# EAGLE design c64 sram at chr-rom (EAGLE 7.3.0)
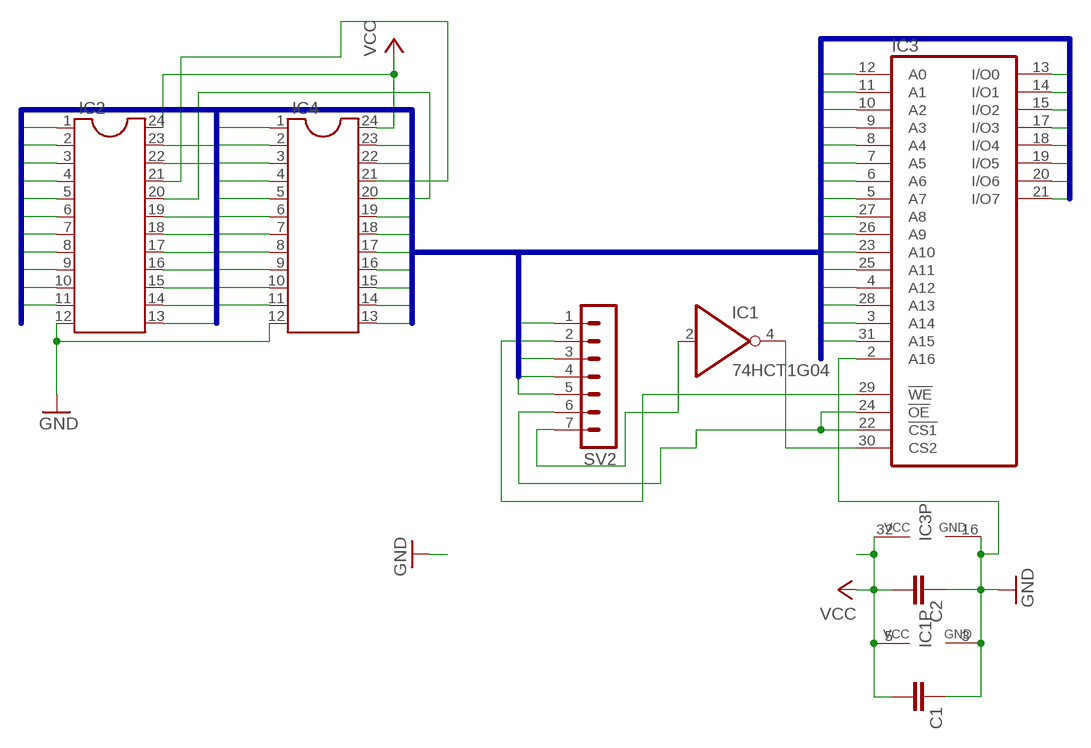
[diagram p0: schematic, sheet 1]

## Parts
C1  C-EUC0805  [C0805]
C2  C-EUC0805  [C0805]
IC1  74HCT1G04  74AHC1G04DBV  [SOT23-5]
IC2  DIL24-6  [DIL24-6]
IC3  LP621024CM  [SOP32L]
IC4  DIL24-6  [DIL24-6]
SV2  MA07-1  [MA07-1]

## Nets
A0: IC2.8 IC3.12(A0) IC4.8
A1: IC2.7 IC3.11(A1) IC4.7
A2: IC2.6 IC3.10(A2) IC4.6
A3: IC2.5 IC3.9(A3) IC4.5
A4: IC2.4 IC3.8(A4) IC4.4
A5: IC2.3 IC3.7(A5) IC4.3
A6: IC2.2 IC3.6(A6) IC4.2
A7: IC2.1 IC3.5(A7) IC4.1
A8: IC2.23 IC3.27(A8) IC4.23
A9: IC2.22 IC3.26(A9) IC4.22
A10: IC2.19 IC3.23(A10) IC4.19
A11: IC2.18 IC3.25(A11) IC4.18
A12: IC3.4(A12) SV2.5
A13: IC3.28(A13) SV2.3
A14: IC3.3(A14) SV2.4
A15: IC3.31(A15) SV2.1
D0: IC2.9 IC3.13(I/O0) IC4.9
D1: IC2.10 IC3.14(I/O1) IC4.10
D2: IC2.11 IC3.15(I/O2) IC4.11
D3: IC2.13 IC3.21(I/O7) IC4.13
D4: IC2.14 IC3.20(I/O6) IC4.14
D5: IC2.15 IC3.19(I/O5) IC4.15
D6: IC2.16 IC3.18(I/O4) IC4.16
D7: IC2.17 IC3.17(I/O3) IC4.17
GND: C1.1 C2.1 IC1.3(GND) IC2.12 IC3.2(A16) IC3.16(GND) IC4.12
N$1: IC2.21 IC4.21
N$3: IC1.4(O) IC3.30(CS2)
N$4: IC2.20 IC4.20
N$10: IC1.2(I) SV2.7
N$11: IC3.22(!CS1) IC3.24(!OE) SV2.6
R/_W: IC3.29(!WE) SV2.2
VCC: C1.2 C2.2 IC1.5(VCC) IC2.24 IC3.32(VCC) IC4.24
Unconnected: IC3.1(NC)

## Buses
A[0..16],D[0..7]

## Library data of the parts
C1 C2 = rcl:C-EU: CAPACITOR, European symbol
IC1 = 74xx-little-de:74*1G04: INVERTER Gate
IC2 IC4 = ic-package:DIL24: Dual In Line
IC3 = memory:LP621024CM: MEMORY
SV2 = con-lstb:MA07-1: PIN HEADER; OC_FARNELL: unknown; OC_NEWARK: unknown

## Board
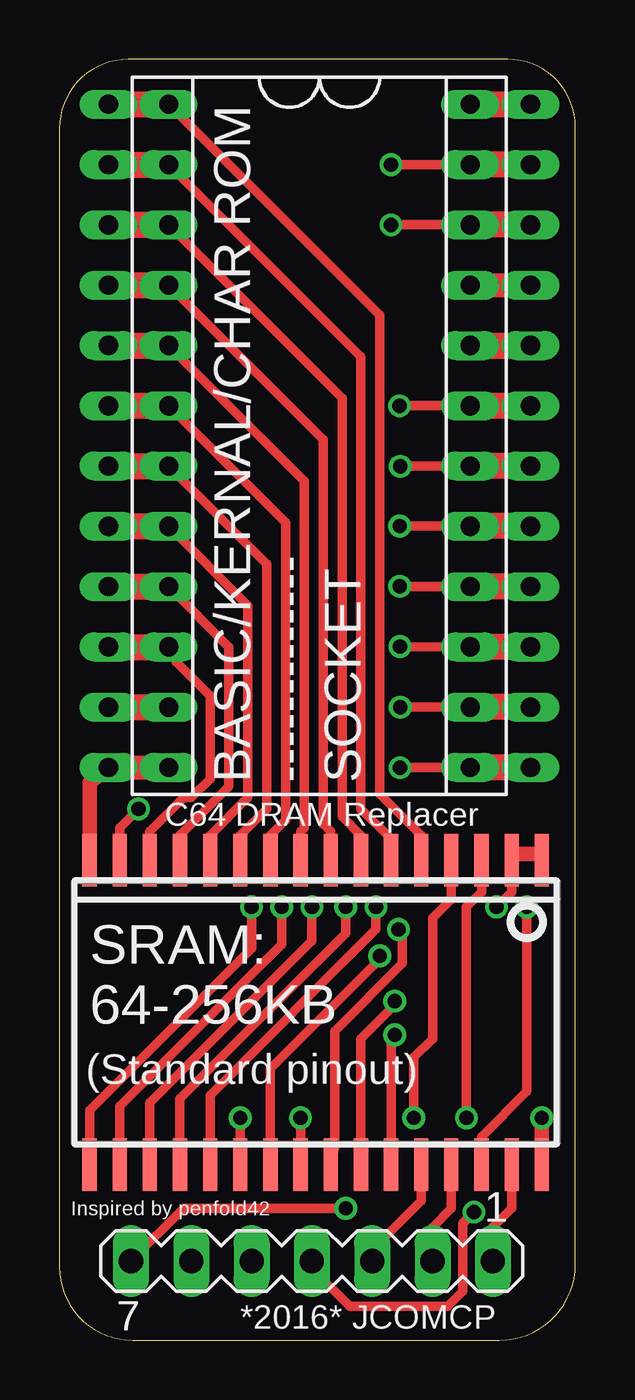
[diagram p1: board, top side]
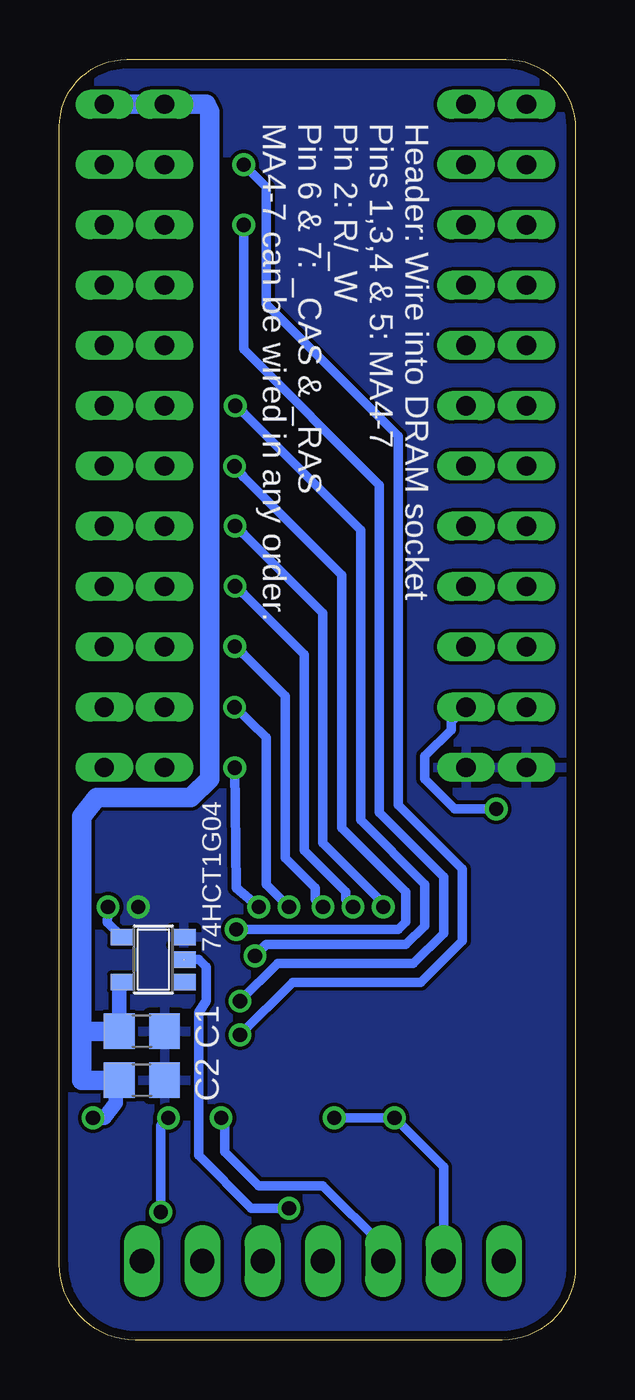
[diagram p2: board, bottom side, seen from below]

Size 21.74 x 53.96 mm. Coordinates in mm from the lower left corner, seen from the top.
Outline: 0,51.06 0,3.08 arc90 3.08,0 18.53,0 arc90 21.74,3.2 21.74,51.12 arc90 18.89,53.97 2.91,53.97 arc90 0,51.06
Copper layers (1*16): Top 0.0356mm / dielectric 1.5011mm / Bottom 0.0356mm
Design rules "oshpark-2layer": minimum track width 6mil, minimum drill 13mil, track to track 6mil, track to pad 6mil, pad to pad 6mil, via to via 6mil, smd to smd 6mil, copper to edge 15mil, drill to drill 6mil, minimum pad ring 7mil, minimum via ring 7mil, stop-mask expansion 4mil, vias tented up to drill 0mil, thermal gap 10mil

### Footprints (pad centres in the part's own frame; a part is rotated, then mirrored left to right if it is on the bottom)
C0805 = smd 1.3 x 1.5: 1 -0.95,0; 2 0.95,0
SOT23-5 = smd 0.69 x 0.99: 1 -0.95,-1.29; 2 0,-1.29; 3 0.95,-1.29; 4 0.95,1.3; 5 -0.95,1.3
DIL24-6 = drill 0.813 long: 1 -13.97,-7.62; 2 -11.43,-7.62; 3 -8.89,-7.62; 4 -6.35,-7.62; 5 -3.81,-7.62; 6 -1.27,-7.62; 7 1.27,-7.62; 8 3.81,-7.62; 9 6.35,-7.62; 10 8.89,-7.62; 11 11.43,-7.62; 12 13.97,-7.62; 13 13.97,7.62; 14 11.43,7.62; 15 8.89,7.62; 16 6.35,7.62; 17 3.81,7.62; 18 1.27,7.62; 19 -1.27,7.62; 20 -3.81,7.62; 21 -6.35,7.62; 22 -8.89,7.62; 23 -11.43,7.62; 24 -13.97,7.62
SOP32L = smd 0.6 x 2.2: 1 -9.525,-6.416; 2 -8.255,-6.416; 3 -6.985,-6.416; 4 -5.715,-6.416; 5 -4.445,-6.416; 6 -3.175,-6.416; 7 -1.905,-6.416; 8 -0.635,-6.416; 9 0.635,-6.416; 10 1.905,-6.416; 11 3.175,-6.416; 12 4.445,-6.416; 13 5.715,-6.416; 14 6.985,-6.416; 15 8.255,-6.416; 16 9.525,-6.416; 17 9.525,6.416; 18 8.255,6.416; 19 6.985,6.416; 20 5.715,6.416; 21 4.445,6.416; 22 3.175,6.416; 23 1.905,6.416; 24 0.635,6.416; 25 -0.635,6.416; 26 -1.905,6.416; 27 -3.175,6.416; 28 -4.445,6.416; 29 -5.715,6.416; 30 -6.985,6.416; 31 -8.255,6.416; 32 -9.525,6.416
MA07-1 = drill 1.016 long: 1 -7.62,0; 2 -5.08,0; 3 -2.54,0; 4 0,0; 5 2.54,0; 6 5.08,0; 7 7.62,0

### Placement (x,y rotation side)
C1  18.26,10.95 180 bottom
C2  18.26,13.02 180 bottom
IC1  17.78,16.03 90 bottom
IC2  9.68,38.1 270 top
IC3  10.79,13.81 180 top
IC4  12.22,38.1 270 top
SV2  10.64,3.33 180 top

### Tracks (layer width: path | path; a pad name or v marks a point on that pad's centre or on a via)
A0
  Top 0.406: IC3.12 6.35,21.27 7.94,22.86 7.94,30.96 IC4.8
  Top 1.1: IC2.8 IC4.8
A1
  Top 0.406: IC3.11 7.62,21.27 8.73,22.38 8.73,32.7 IC4.7
  Top 1.1: IC2.7 IC4.7
A2
  Top 0.406: IC3.10 8.89,21.27 9.53,21.91 9.53,34.45 IC4.6
  Top 1.1: IC2.6 IC4.6
A3
  Top 0.406: IC3.9 10.16,21.43 10.32,21.59 10.32,36.2 IC4.5
  Top 1.1: IC2.5 IC4.5
A4
  Top 0.406: IC3.8 11.43,21.43 11.11,21.75 11.11,37.94 IC4.4
  Top 1.1: IC2.4 IC4.4
A5
  Top 0.406: IC3.7 12.7,21.27 11.91,22.07 11.91,39.69 IC4.3
  Top 1.1: IC2.3 IC4.3
A6
  Top 0.406: IC3.6 13.97,21.11 12.7,22.38 12.7,41.43 IC4.2
  Top 1.1: IC2.2 IC4.2
A7
  Top 0.406: IC3.5 15.24,21.27 13.49,23.02 13.49,43.18 IC4.1
  Top 1.1: IC2.1 IC4.1
A8  (via drill 0.6)
  Top 0.406: IC2.23 v13.97,49.53 | v14.13,12.86 13.97,12.7 IC3.27
  Top 1.1: IC4.23 IC2.23
  Bottom 0.406: v13.97,49.53 13.02,48.58 13.02,43.66 7.46,38.1 7.46,22.54 4.76,19.84 4.76,16.83 6.51,15.08 11.91,15.08 v14.13,12.86
A9  (via drill 0.6)
  Top 0.406: IC2.22 v13.97,46.99 | v14.13,14.29 14.13,14.13 12.7,12.7 IC3.26
  Top 1.1: IC4.22 IC2.22
  Bottom 0.406: v13.97,46.99 13.97,41.75 8.26,36.04 8.26,22.23 5.56,19.53 5.56,17.15 6.83,15.88 12.54,15.88 v14.13,14.29
A10  (via drill 0.6)
  Top 0.406: IC2.19 v14.33,39.37 | v13.49,16.19 13.49,16.03 8.89,11.43 IC3.23
  Top 1.1: IC2.19 IC4.19
  Bottom 0.406: v14.33,39.37 13.97,39.05 9.05,34.13 9.05,21.91 6.35,19.21 6.35,17.46 7.14,16.67 13.02,16.67 v13.49,16.19
A11  (via drill 0.6)
  Top 0.406: IC2.18 v14.36,36.82 | v14.29,17.3 14.45,16.99 14.45,15.88 11.59,13.02 11.59,8.19 IC3.25
  Top 1.1: IC4.18 IC2.18
  Bottom 0.406: v14.36,36.82 13.97,36.35 9.84,32.23 9.84,21.59 7.14,18.89 7.14,17.62 7.46,17.3 v14.29,17.3
A12  (via drill 0.6)
  Top 0.406: v14.92,9.37 14.92,11.91 15.72,12.7 15.72,17.78 16.51,18.57 IC3.4
  Bottom 0.406: SV2.5 8.1,3.97 10.64,6.51 13.34,6.51 14.76,7.94 14.76,9.21 v14.92,9.37
A13
  Top 0.406: SV2.3 13.18,3.81 15.24,5.87 IC3.28
A14  (via drill 0.6)
  Top 0.406: SV2.4 10.64,3.02 12.22,1.43 16.35,1.43 16.99,2.06 16.99,4.92 v17.46,5.4 | v17.14,9.37 17.14,18.26 17.78,18.89 IC3.3
  Bottom 0.406: v17.46,5.4 17.46,9.05 v17.14,9.37
A15
  Top 0.406: SV2.1 18.26,4.76 19.05,5.56 IC3.31
D0
  Top 0.406: IC3.13 5.08,21.27 7.14,23.34 7.14,29.21 IC4.9
  Top 1.1: IC2.9 IC4.9
D1
  Top 0.406: IC3.14 3.81,21.43 5.24,22.86 5.56,22.86 6.35,23.65 6.35,27.15 4.92,28.58 4.92,28.89 IC4.10
  Top 1.1: IC2.10 IC4.10
D2  (via drill 0.6)
  Top 0.406: IC3.15 2.54,21.59 v3.33,22.38
  Top 1.1: IC2.11 IC4.11
  Bottom 0.406: v3.33,22.38 5.08,22.38 6.35,23.65 6.35,24.61 5.24,25.72 5.24,26.04 IC4.11
D3  (via drill 0.6)
  Top 0.406: IC2.13 v14.35,24.12 | v13.34,18.26 13.34,17.3 6.35,10.32 IC3.21
  Top 1.1: IC4.13 IC2.13
  Bottom 0.406: v13.34,18.26 14.29,19.05 v14.35,24.12
D4  (via drill 0.6)
  Top 0.406: IC2.14 v14.36,26.67 | v12.06,18.26 12.06,17.15 5.08,10.16 IC3.20
  Top 1.1: IC4.14 IC2.14
  Bottom 0.406: v14.36,26.67 13.02,25.4 13.02,19.21 v12.06,18.26
D5  (via drill 0.6)
  Top 0.406: IC2.15 v14.35,29.23 | v10.64,18.26 10.64,16.83 3.81,10 IC3.19
  Top 1.1: IC4.15 IC2.15
  Bottom 0.406: v14.35,29.23 13.97,28.89 12.22,27.15 12.22,20.32 10.95,19.05 10.95,18.57 v10.64,18.26
D6  (via drill 0.6)
  Top 0.406: IC2.16 v14.34,31.76 | v9.37,18.26 9.37,16.67 2.54,9.84 IC3.18
  Top 1.1: IC4.16 IC2.16
  Bottom 0.406: v14.34,31.76 13.97,31.43 11.43,28.89 11.43,20.64 9.68,18.89 9.68,18.57 v9.37,18.26
D7  (via drill 0.6)
  Top 0.406: IC2.17 v14.34,34.3 | v8.1,18.26 8.1,16.51 1.27,9.68 IC3.17
  Top 1.1: IC4.17 IC2.17
  Bottom 0.406: v14.34,34.3 13.97,33.97 10.64,30.64 10.64,20.96 8.26,18.57 v8.1,18.26
GND  (via drill 0.6)
  Top 0.406: 19.05,20.48 19.21,20.48 | IC3.2 19.05,18.89 v18.41,18.26
  Top 0.61: IC3.16 1.27,23.5 IC2.12 | IC3.2 19.05,20.48 | 20.32,20.48 19.21,20.48
  Top 1.016: IC2.12 IC4.12
  Bottom 0.813: IC2.12 2.06,23.97
  pour Bottom: 0,-0.16 0,53.5 22.23,53.66 22.23,0
N$1
  Top 1.016: IC2.21 IC4.21
N$3  (via drill 0.6)
  Top 0.406: v19.68,18.26 19.68,10.48 17.78,8.57 IC3.30
  Bottom 0.406: IC1.4 19.71,17.59 v19.68,18.26
N$4
  Top 1.1: IC2.20 IC4.20
N$10  (via drill 0.6)
  Top 0.406: v12.06,5.56 5.24,5.56 SV2.7
  Bottom 0.406: IC1.2 15.88,16.03 15.56,15.72 15.56,14.29 15.88,13.81 15.88,7.78 13.65,5.56 v12.06,5.56
N$11  (via drill 0.6)
  Top 0.406: v7.62,9.37 IC3.22 | v10.16,9.37 IC3.24
  Bottom 0.406: SV2.6 5.56,7.3 v7.62,9.37 v10.16,9.37
R/_W
  Top 0.406: SV2.2 15.72,4.76 16.51,5.56 IC3.29
VCC  (via drill 0.6)
  Top 0.61: IC3.32 v20.32,9.37
  Top 1.1: IC2.24 IC4.24
  Bottom 0.61: C2.2 19.21,13.65 19.21,15.08 19.21,14.77 IC1.5 | v20.32,9.37 19.84,9.37 19.37,10 19.37,11.11 C1.2
  Bottom 0.813: IC4.24 15.56,52.07 15.4,51.75 15.4,43.82 15.4,43.66 15.4,23.65 16.19,22.86 20.16,22.86 20.8,22.07 20.8,13.02 | 20.8,13.02 20.8,10.95 C1.2 | C2.2 20.8,13.02

### Text on the board
tPlace: BASIC/KERNAL/CHAR ROM / ------------- / SOCKET | C64 DRAM Replacer | SRAM: / 64-256KB | (Standard pinout) | Inspired by penfold42 | *2016* JCOMCP
bPlace: Header: Wire into DRAM socket / Pins 1,3,4 & 5: MA4-7 / Pin 2: R/_W / Pin 6 & 7: _CAS & _RAS / MA4-7 can be wired in any order.